# Altium schematic sheet Serial.SchDoc
size A4
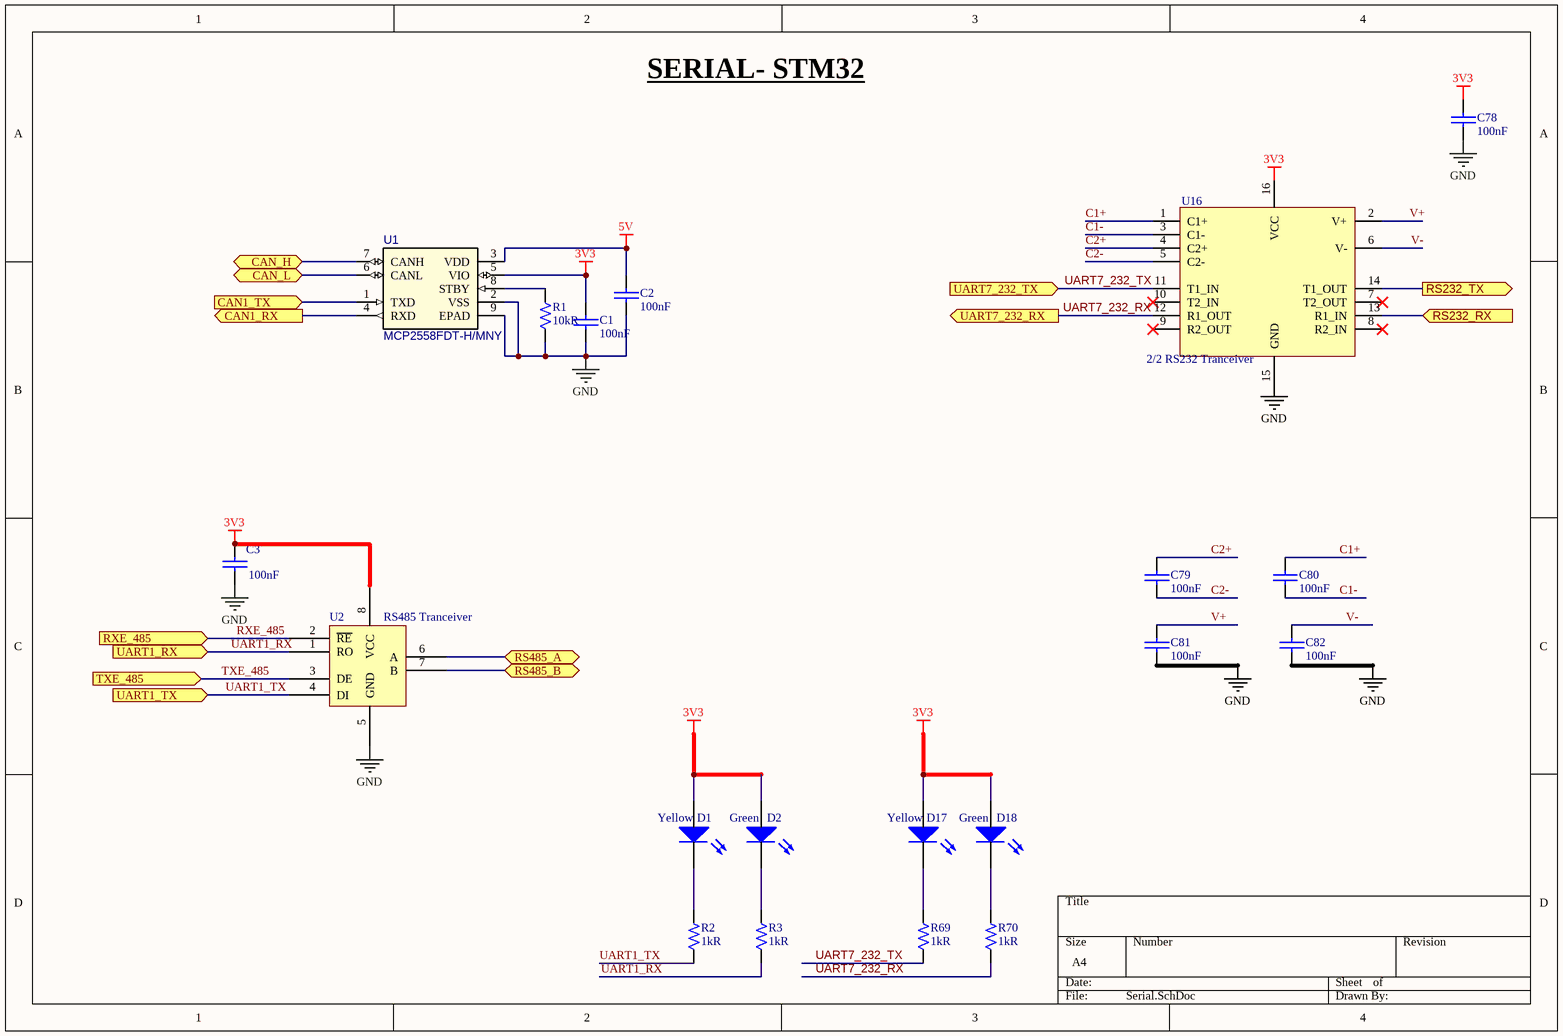
[diagram p0: Serial.SchDoc]

## Parts
C1  Capacitance: 100nF  [CAP0402]  (hidden comment: Capacitor)
C2  Capacitance: 100nF  [CAP0402]  (hidden comment: Capacitor)
C3  Capacitance: 100nF  [CAP0402]  (hidden comment: Capacitor)
C78  Capacitance: 100nF  [CAP0402]  (hidden comment: Capacitor)
C79  Capacitance: 100nF  [CAP0402]  (hidden comment: Capacitor)
C80  Capacitance: 100nF  [CAP0402]  (hidden comment: Capacitor)
C81  Capacitance: 100nF  [CAP0402]  (hidden comment: Capacitor)
C82  Capacitance: 100nF  [CAP0402]  (hidden comment: Capacitor)
D1  Colour: Yellow  [LED-0603-YELLOW]  (hidden comment: LED)
D2  Colour: Green  [LED-0603-GREEN]  (hidden comment: LED)
D17  Colour: Yellow  [LED-0603-YELLOW]  (hidden comment: LED)
D18  Colour: Green  [LED-0603-GREEN]  (hidden comment: LED)
R1  Resistance: 10kR  [RES0402]  (hidden comment: Resistor)
R2  Resistance: 1kR  [RES0402]  (hidden comment: Resistor)
R3  Resistance: 1kR  [RES0402]  (hidden comment: Resistor)
R69  Resistance: 1kR  [RES0402]  (hidden comment: Resistor)
R70  Resistance: 1kR  [RES0402]  (hidden comment: Resistor)
U1  MCP2558FDT-H/MNY  [TDFN8_2x3_MN]
U2  RS485 Tranceiver  [MAX22501EATA+]
U16  2/2 RS232 Tranceiver  [ST3232ECTR]

## Ports
CAN1_RX (out), CAN1_TX (in), CAN_H (bidir), CAN_L (bidir), RS232_RX (in), RS232_TX (out), RS485_A (bidir), RS485_B (bidir), RXE_485 (in), TXE_485 (in), UART1_RX (in), UART1_TX (in), UART7_232_RX (out), UART7_232_TX (in)

## Nets
3V3: C1.1 C3.1 C78.1 D1.2 D2.2 D17.2 D18.2 U1.5(VIO) U2.8(VCC) U16.16(VCC)
5V: C2.1 U1.3(VDD)
GND: C1.2 C2.2 C3.2 C78.2 C81.2 C82.2 R1.1 U1.2(VSS) U1.9(EPAD) U2.5(GND) U16.15(GND)
C1+: C80.1 U16.1(C1+)
C1-: C80.2 U16.3(C1-)
C2+: C79.1 U16.4(C2+)
C2-: C79.2 U16.5(C2-)
CAN1_RX: U1.4(RXD) ; port CAN1_RX
CAN1_TX: U1.1(TXD) ; port CAN1_TX
CAN_H: U1.7(CANH) ; port CAN_H
CAN_L: U1.6(CANL) ; port CAN_L
RS232_RX: U16.13(R1_IN) ; port RS232_RX
RS232_TX: U16.14(T1_OUT) ; port RS232_TX
RS485_A: U2.6(A) ; port RS485_A
RS485_B: U2.7(B) ; port RS485_B
RXE_485: U2.2(~{RE}) ; port RXE_485
TXE_485: U2.3(DE) ; port TXE_485
UART1_RX: R3.1 U2.1(RO) ; port UART1_RX
UART1_TX: R2.1 U2.4(DI) ; port UART1_TX
UART7_232_RX: R70.1 U16.12(R1_OUT) ; port UART7_232_RX
UART7_232_TX: R69.1 U16.11(T1_IN) ; port UART7_232_TX
V+: C81.1 U16.2(V+)
V-: C82.1 U16.6(V-)
NetD1_1: D1.1 R2.2
NetD2_1: D2.1 R3.2
NetD17_1: D17.1 R69.2
NetD18_1: D18.1 R70.2
NetR1_2: R1.2 U1.8(STBY)

Not connected (* = marked no-connect by the designer): U16 7(T2_OUT)* 8(R2_IN)* 9(R2_OUT)* 10(T2_IN)*

## Notes on the sheet
- SERIAL- STM32

## Library data of the parts
C1-C3 C78-C82 = Capacitor: Manufacturer: TDK; Manufacturer Part Number: CGA2B3X7R1H104K050BB; Voltage Rating: 50V; Tolerance: 10%; Dielectric: X7R; Supplier 1: Digi-Key; Supplier Part Number 1: 445-6899-1-ND; Stock 1: 14098587; Mount: Surface Mount; Case/Package: 0402; Weight: 2.3E-05oz; Case Code (Metric): 1005; Case Code (Imperial): 0402; Min Operating Temperature: -55°C; Max Operating Temperature: 125°C; Packaging: Tape and Reel; Package Quantity: 1; Voltage Rating (DC): 50V; Termination: SMD/SMT; Composition: Ceramic; Voltage: 50V; Length: 1mm; Height: 0.5mm; Width: 0.02inch; Thickness: 0.022inch; Depth: 0.5mm; Ratings: AEC-Q200; REACH SVHC: No SVHC; Lead Free: Lead Free; ComponentLink1URL: http://product.tdk.com/capacitor/mlcc/en/documents/mlccspec_automotive_general_midvoltage_en.pdf?src-supplier=Future+Electronics; ComponentLink1Description: http://product.tdk.com/capacitor/mlcc/en/documents/mlccspec_automotive_general_midvoltage_en.pdf?src-supplier=Future+Electronics; ComponentLink2URL: http://www.farnell.com/datasheets/1807242.pdf?src-supplier=Element14; ComponentLink2Description: http://www.farnell.com/datasheets/1807242.pdf?src-supplier=Element14; ComponentLink3URL: http://www.mouser.com/ds/2/400/lcc_automotive_general_en-843974.pdf?src-supplier=Mouser; ComponentLink3Description: http://www.mouser.com/ds/2/400/lcc_automotive_general_en-843974.pdf?src-supplier=Mouser; ComponentLink4URL: http://www.farnell.com/datasheets/1936565.pdf?src-supplier=Element14; ComponentLink4Description: http://www.farnell.com/datasheets/1936565.pdf?src-supplier=Element14; ComponentLink5URL: http://www.farnell.com/datasheets/1735392.pdf?src-supplier=Element14; ComponentLink5Description: http://www.farnell.com/datasheets/1735392.pdf?src-supplier=Element14
D1 D17 = LED: Manufacturer: Wurth Electronics Inc.; Manufacturer Part Number: 150060YS75000; Component Type: Yellow 590nm LED Indication - Discrete 2V 0603 (1608 Metric); Price: 0.39; Supplier: Digi-Key; Supplier Part Number: 732-4981-1-ND
D2 D18 = LED: Manufacturer: Wurth Electronics Inc.; Manufacturer Part Number: 150060GS75000; Component Type: Green 520nm LED Indication - Discrete 3.2V 0603 (1608 Metric); Price: 0.39; Supplier: Digi-Key; Supplier Part Number: 732-4971-1-ND
R1 = Resistor: Manufacturer 1: Panasonic; Manufacturer Part Number 1: ERJ-2RKF1002X; Power Rating: 100mW; Tolerance: 1%; Voltage Rating: 50V; Temperature Coefficient: 100ppm/°C; Supplier 1: Digi-Key; Supplier Part Number 1: P10.0KLDKR-ND; Stock 1: 3290329; Pricing 1: 1=0,10000, 10=0,04100, 100=0,01680, 1000=0,00753, 2500=0,00653, 5000=0,00540 (USD); RoHS: Yes; Mount: Surface Mount; Case/Package: 0402; Number of Pins: 2; Contact Plating: Tin; Case Code (Metric): 1005; Case Code (Imperial): 0402; Min Operating Temperature: -55°C; Max Operating Temperature: 155°C; Packaging: Tape and Reel; Package Quantity: 1; Voltage Rating (DC): 50V; Features: Automotive AEC-Q200; Max Power Dissipation: 100mW; Composition: Thick Film; Number of Terminations: 2; Termination: SMD/SMT; Military Standard: Not; Length: 1mm; Height: 0.35mm; Width: 0.02inch; Depth: 0.5mm; Radiation Hardening: No; Lead Free: Lead Free; REACH SVHC: No SVHC; ComponentLink1URL: https://datasheet.ciiva.com/11821/0900766b80f80784-11821171.pdf?src-supplier=RSComponents; ComponentLink1Description: https://datasheet.ciiva.com/11821/0900766b80f80784-11821171.pdf?src-supplier=RSComponents; ComponentLink2URL: https://datasheet.ciiva.com/16199/aoa0000ce2-16199478.pdf?src-supplier=Future+Electronics; ComponentLink2Description: https://datasheet.ciiva.com/16199/aoa0000ce2-16199478.pdf?src-supplier=Future+Electronics; ComponentLink3URL: https://datasheet.ciiva.com/17212/aoa0000ce2-17212102.pdf?src-supplier=Avnet+Europe; ComponentLink3Description: https://datasheet.ciiva.com/17212/aoa0000ce2-17212102.pdf?src-supplier=Avnet+Europe; ComponentLink4URL: https://datasheet.ciiva.com/24023/aoa0000ce2-24023017.pdf?src-supplier=Mouser; ComponentLink4Description: https://datasheet.ciiva.com/24023/aoa0000ce2-24023017.pdf?src-supplier=Mouser; ComponentLink5URL: https://datasheet.ciiva.com/28514/1678782-28514185.pdf?src-supplier=Element14; ComponentLink5Description: https://datasheet.ciiva.com/28514/1678782-28514185.pdf?src-supplier=Element14; ComponentLink6URL: https://datasheet.ciiva.com/43467/1678782-43467402.pdf?src-supplier=Farnell; ComponentLink6Description: https://datasheet.ciiva.com/43467/1678782-43467402.pdf?src-supplier=Farnell; ComponentLink7URL: https://datasheet.ciiva.com/27055/1987020-27055643.pdf?src-supplier=Jameco; ComponentLink7Description: https://datasheet.ciiva.com/27055/1987020-27055643.pdf?src-supplier=Jameco; ComponentLink8URL: https://datasheet.ciiva.com/48531/aoa0000ce2-48531069.pdf?src-supplier=Avnet; ComponentLink8Description: https://datasheet.ciiva.com/48531/aoa0000ce2-48531069.pdf?src-supplier=Avnet; ComponentLink9URL: https://datasheet.ciiva.com/9194/aoa0000ce2-9194142.pdf?src-supplier=Avnet; ComponentLink9Description: https://datasheet.ciiva.com/9194/aoa0000ce2-9194142.pdf?src-supplier=Avnet; ComponentLink10URL: https://datasheet.ciiva.com/16782/70260748-16782590.pdf?src-supplier=Allied+Electronics; ComponentLink10Description: https://datasheet.ciiva.com/16782/70260748-16782590.pdf?src-supplier=Allied+Electronics; ComponentLink11URL: https://datasheet.ciiva.com/16786/70260748-16786734.pdf?src-supplier=Allied+Electronics; ComponentLink11Description: https://datasheet.ciiva.com/16786/70260748-16786734.pdf?src-supplier=Allied+Electronics; ComponentLink12URL: https://datasheet.ciiva.com/30201/aoa0000ce2-30201022.pdf?src-supplier=Onlinecomponents.com; ComponentLink12Description: https://datasheet.ciiva.com/30201/aoa0000ce2-30201022.pdf?src-supplier=Onlinecomponents.com
R2 R3 R69 R70 = Resistor: Manufacturer 1: Panasonic; Manufacturer Part Number 1: ERJ-2GEJ102X; Temperature Coefficient: 200ppm/°C; Voltage Rating (DC): 50V; Tolerance: 5%; Power Rating: 100mW; Supplier 1: Digi-Key; Supplier Part Number 1: P1.0KJCT-ND; Stock 1: 3554258; Pricing 1: 1=0,10000, 10=0,03200, 100=0,01290, 1000=0,00578, 2500=0,00502, 5000=0,00414 (USD); RoHS: Yes; Mount: Surface Mount; Case/Package: 0402; Case Code (Metric): 1005; Case Code (Imperial): 0402; Contact Plating: Tin; Min Operating Temperature: -55°C; Max Operating Temperature: 155°C; Composition: Thick Film; Number of Terminations: 2; Termination: SMD/SMT; Military Standard: Not; Packaging: Tape and Reel; Voltage Rating: 50V; Package Quantity: 1; Features: Automotive AEC-Q200; Max Power Dissipation: 100mW; Working Voltage: 50V; Length: 1mm; Height: 0.35mm; Depth: 0.5mm; Width: 0.02inch; Radiation Hardening: No; Lead Free: Lead Free; REACH SVHC: No SVHC; ComponentLink1URL: https://datasheet.ciiva.com/11821/0900766b80f806dd-11821202.pdf?src-supplier=RSComponents; ComponentLink1Description: https://datasheet.ciiva.com/11821/0900766b80f806dd-11821202.pdf?src-supplier=RSComponents; ComponentLink2URL: https://datasheet.ciiva.com/34303/1986781-34303542.pdf?src-supplier=Jameco; ComponentLink2Description: https://datasheet.ciiva.com/34303/1986781-34303542.pdf?src-supplier=Jameco; ComponentLink3URL: https://datasheet.ciiva.com/16762/70260739-16762170.pdf?src-supplier=Allied+Electronics; ComponentLink3Description: https://datasheet.ciiva.com/16762/70260739-16762170.pdf?src-supplier=Allied+Electronics; ComponentLink4URL: https://datasheet.ciiva.com/17215/aoa0000ce1-17215306.pdf?src-supplier=Avnet+Europe; ComponentLink4Description: https://datasheet.ciiva.com/17215/aoa0000ce1-17215306.pdf?src-supplier=Avnet+Europe; ComponentLink5URL: https://datasheet.ciiva.com/43460/1500035-43460379.pdf?src-supplier=Farnell; ComponentLink5Description: https://datasheet.ciiva.com/43460/1500035-43460379.pdf?src-supplier=Farnell; ComponentLink6URL: https://datasheet.ciiva.com/16199/aoa0000ce1-16199541.pdf?src-supplier=Future+Electronics; ComponentLink6Description: https://datasheet.ciiva.com/16199/aoa0000ce1-16199541.pdf?src-supplier=Future+Electronics; ComponentLink7URL: https://datasheet.ciiva.com/30219/4aoa0000ce1-30219159.pdf?src-supplier=Onlinecomponents.com; ComponentLink7Description: https://datasheet.ciiva.com/30219/4aoa0000ce1-30219159.pdf?src-supplier=Onlinecomponents.com; ComponentLink8URL: https://datasheet.ciiva.com/22783/1500035-22783817.pdf?src-supplier=Farnell; ComponentLink8Description: https://datasheet.ciiva.com/22783/1500035-22783817.pdf?src-supplier=Farnell; ComponentLink9URL: https://datasheet.ciiva.com/48531/aoa0000ce1-48531081.pdf?src-supplier=Avnet; ComponentLink9Description: https://datasheet.ciiva.com/48531/aoa0000ce1-48531081.pdf?src-supplier=Avnet; ComponentLink10URL: https://datasheet.ciiva.com/46386/1500035-46386458.pdf?src-supplier=Element14; ComponentLink10Description: https://datasheet.ciiva.com/46386/1500035-46386458.pdf?src-supplier=Element14; ComponentLink11URL: https://datasheet.ciiva.com/16511/aoa0000ce1-16511421.pdf?src-supplier=Avnet+Asia; ComponentLink11Description: https://datasheet.ciiva.com/16511/aoa0000ce1-16511421.pdf?src-supplier=Avnet+Asia; ComponentLink12URL: https://datasheet.ciiva.com/46371/1500035-46371935.pdf?src-supplier=Element14; ComponentLink12Description: https://datasheet.ciiva.com/46371/1500035-46371935.pdf?src-supplier=Element14
U1 = MCP2558FDT-H/MNY: Can Fd Transceiver With Silent Mode / 8 Tdfn 2X3X0.8Mm T/r; Vendor: Microchip; Receiver Hysteresis: 200mV; Manufacturer_Part_Number: MCP2558FDT-H/MNY; Supplier 1: Digi-Key; Supplier Part Number 1: MCP2558FDT-H/MNYCT-ND; Manufacturer 1: Microchip; Manufacturer Part Number 1: MCP2558FDT-H/MNY; RoHS: Yes; Category: Interface ICs; Stock 1: 6428; Pricing 1: 1=0,85000, 25=0,70000, 100=0,69000 (USD); Mount: Surface Mount; Min Operating Temperature: -40°C; Max Operating Temperature: 150°C; Packaging: Tape and Reel; RoHS Compliant: Yes; ComponentLink1URL: http://www.microchip.com/mymicrochip/filehandler.aspx?ddocname=en585652&src-supplier=Digi-Key; ComponentLink1Description: http://www.microchip.com/mymicrochip/filehandler.aspx?ddocname=en585652&src-supplier=Digi-Key
U2 = MAX22501EATA+: Manufacturer: Maxim Integrated; Price: 2.91; Supplier Part Number: MAX22501EATA+-ND; Manufacturer Part Number: MAX22501EATA+; Component Type: 1/1 Transceiver Half RS422, RS485 8-TDFN (3x3); Supplier: Digi-Key
U16 = ST3232ECTR: Manufacturer: STMicroelectronics; Price: 1.41; Manufacturer Part Number: ST3232ECTR; Supplier: Digi-Key; Supplier Part Number: 497-6538-1-ND; Component Type: 2/2 Transceiver Full RS232 16-TSSOP